# EAGLE schematic m220noadder (EAGLE 4.11)
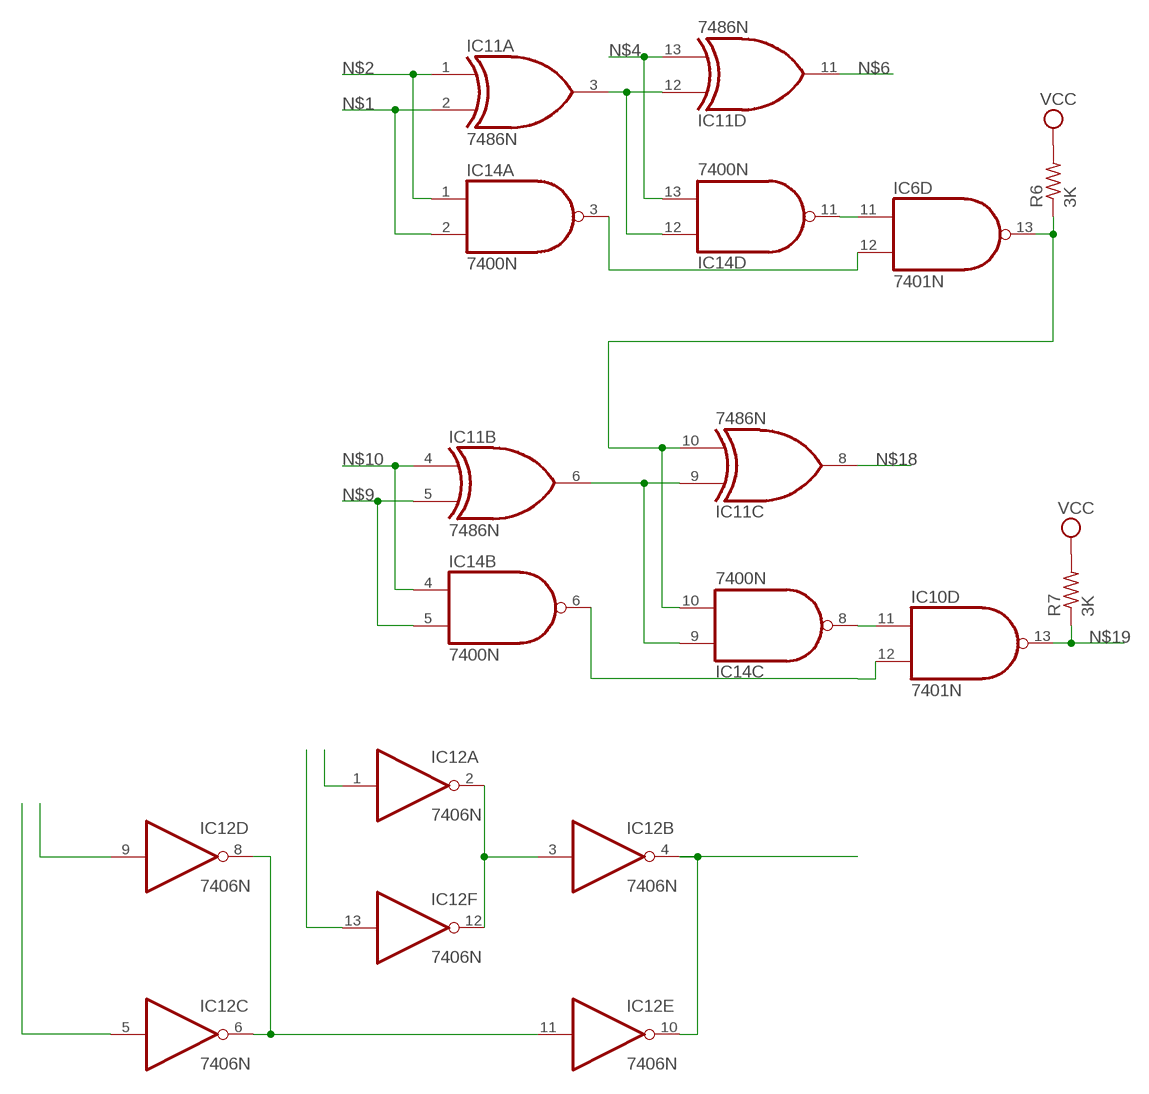
[diagram p0: schematic, sheet 1, part 1 of 2]
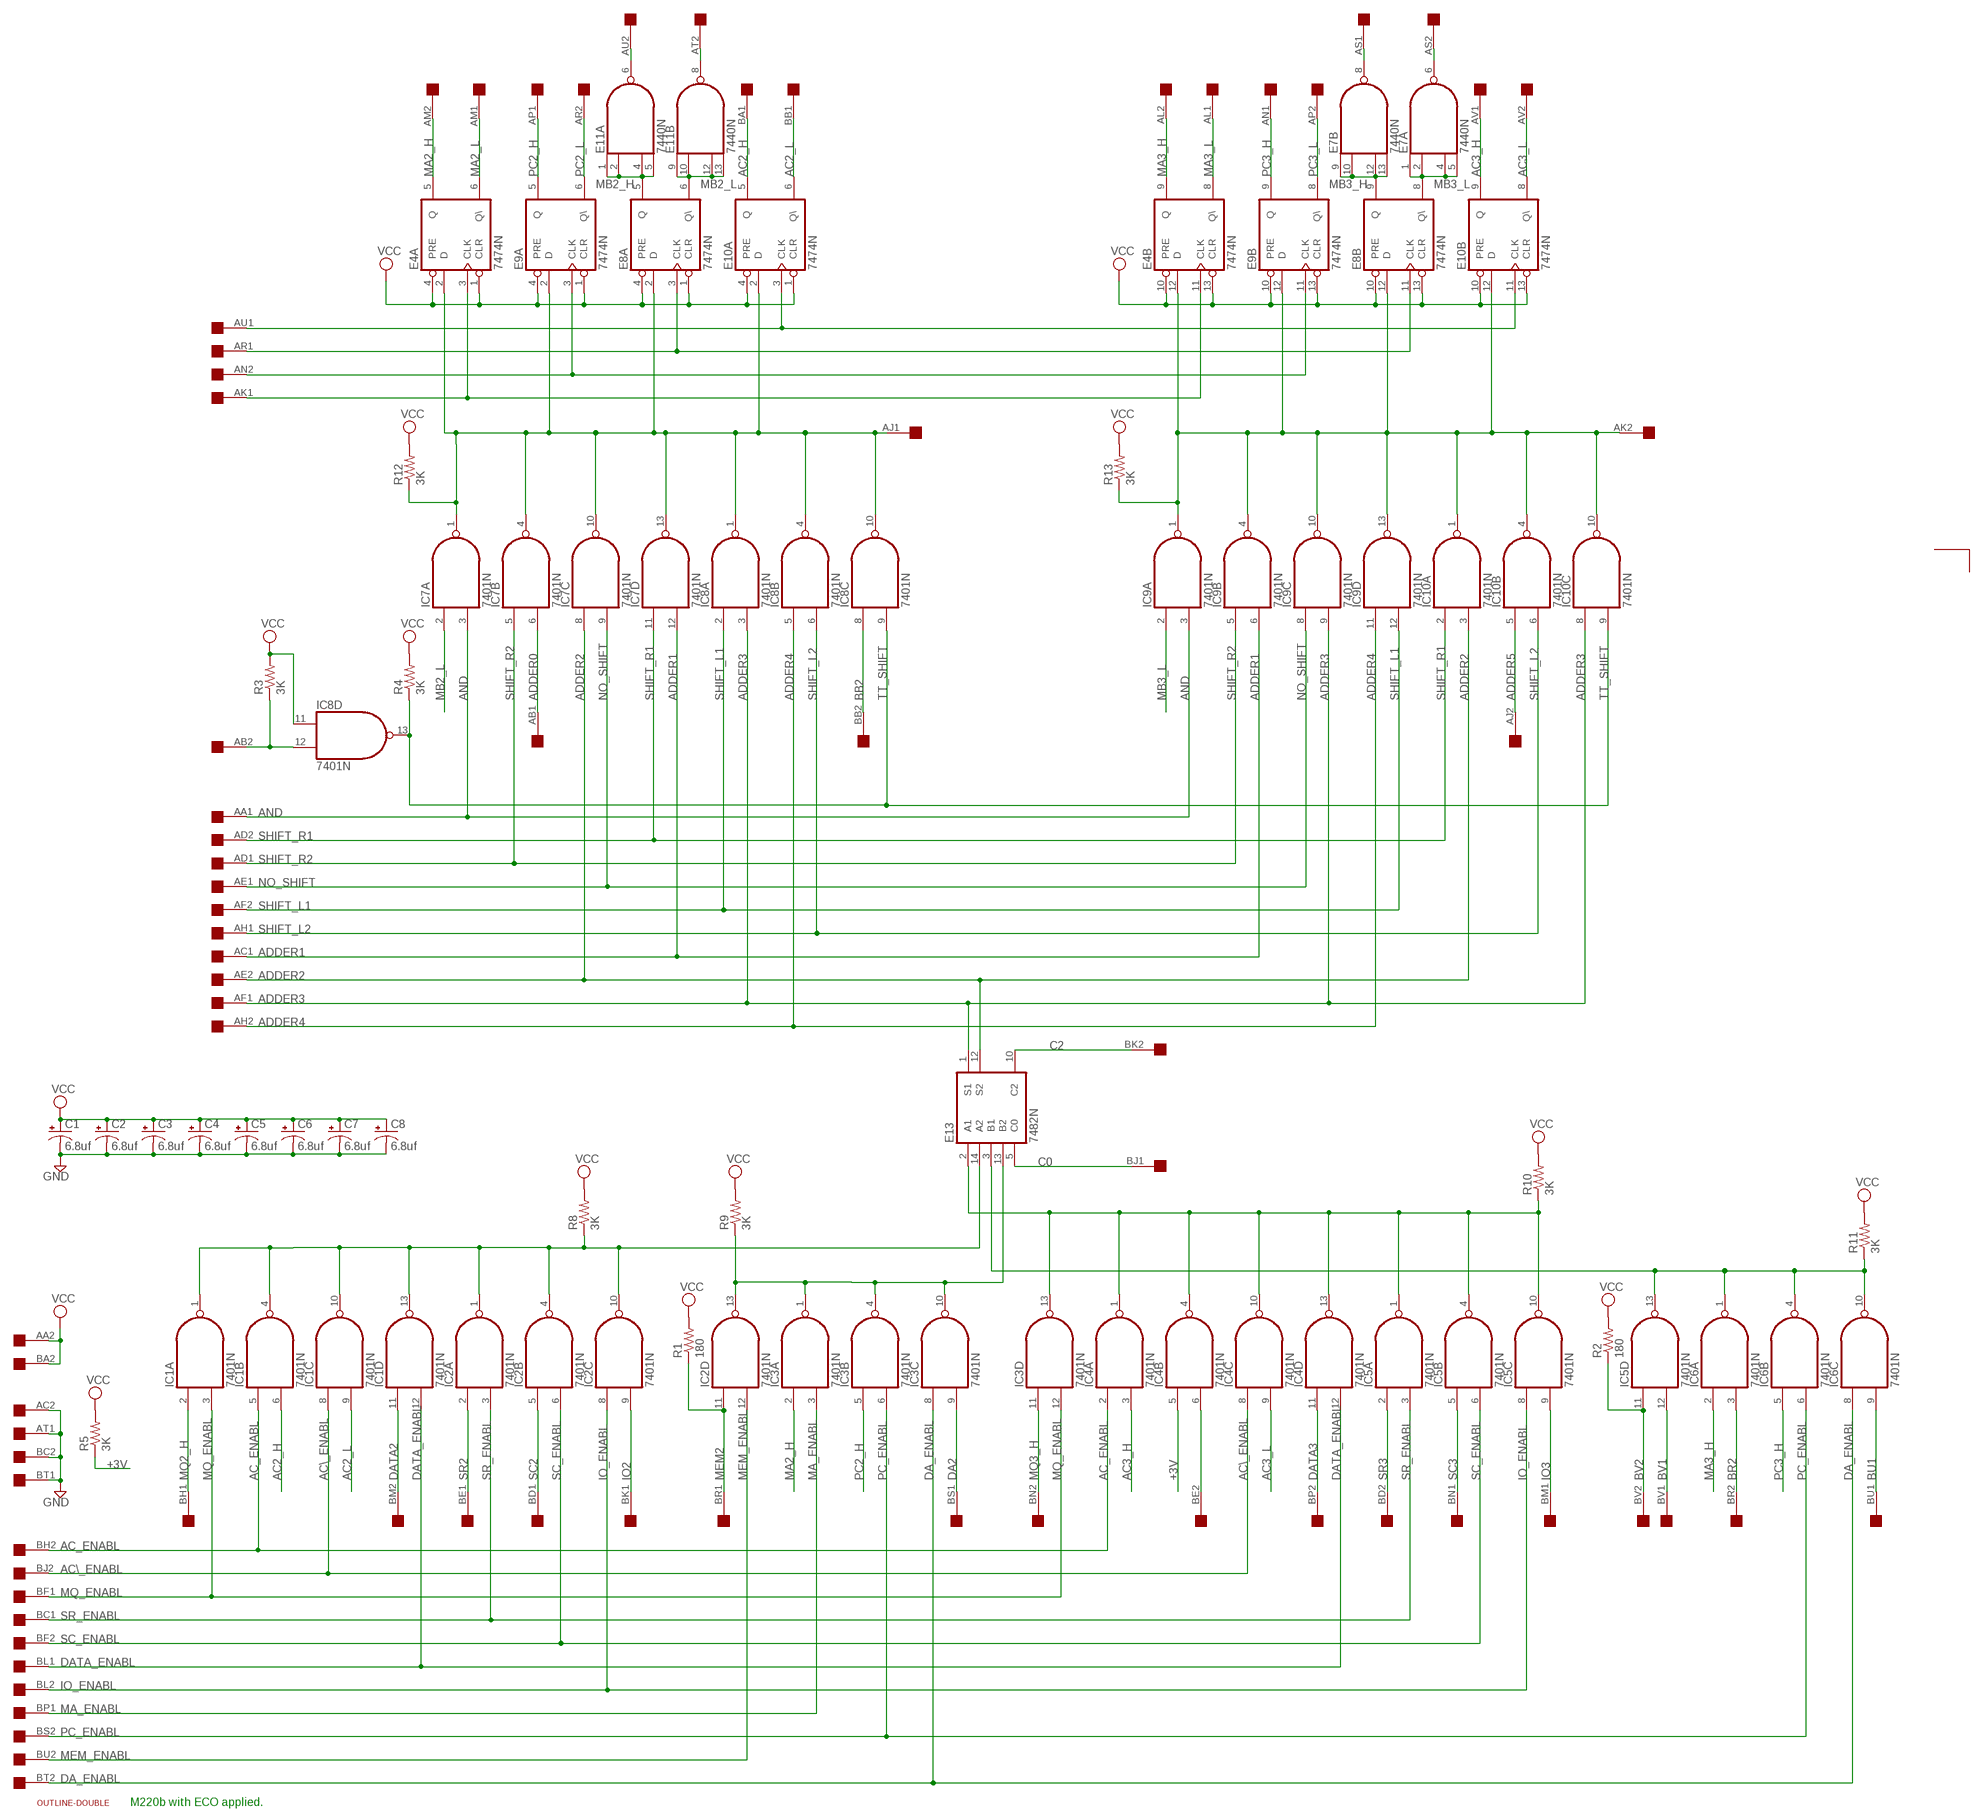
[diagram p1: schematic, sheet 1, part 2 of 2]

## Parts
C1  6.8uf  CPOL-USE15-5AXIAL  [E15-5]
C2  6.8uf  CPOL-USE15-5AXIAL  [E15-5]
C3  6.8uf  CPOL-USE15-5AXIAL  [E15-5]
C4  6.8uf  CPOL-USE15-5AXIAL  [E15-5]
C5  6.8uf  CPOL-USE15-5AXIAL  [E15-5]
C6  6.8uf  CPOL-USE15-5AXIAL  [E15-5]
C7  6.8uf  CPOL-USE15-5AXIAL  [E15-5]
C8  6.8uf  CPOL-USE15-5AXIAL  [E15-5]
E4  7474N  74S74N  [DIL14]
E7  7440N  74S20N  [DIL14]
E8  7474N  74S74N  [DIL14]
E9  7474N  74S74N  [DIL14]
E10  7474N  74S74N  [DIL14]
E11  7440N  74S20N  [DIL14]
E13  7482N  [DIL14]
IC1  7401N  [DIL14]
IC2  7401N  [DIL14]
IC3  7401N  [DIL14]
IC4  7401N  [DIL14]
IC5  7401N  [DIL14]
IC6  7401N  [DIL14]
IC7  7401N  [DIL14]
IC8  7401N  [DIL14]
IC9  7401N  [DIL14]
IC10  7401N  [DIL14]
IC11  7486N  [DIL14]
IC12  7406N  [DIL14]
IC14  7400N  [DIL14]
R1  180  R-US_0207/10  [0207/10]
R2  180  R-US_0207/10  [0207/10]
R3  3K  R-US_0207/10  [0207/10]
R4  3K  R-US_0207/10  [0207/10]
R5  3K  R-US_0207/10  [0207/10]
R6  3K  R-US_0207/10  [0207/10]
R7  3K  R-US_0207/10  [0207/10]
R8  3K  R-US_0207/10  [0207/10]
R9  3K  R-US_0207/10  [0207/10]
R10  3K  R-US_0207/10  [0207/10]
R11  3K  R-US_0207/10  [0207/10]
R12  3K  R-US_0207/10  [0207/10]
R13  3K  R-US_0207/10  [0207/10]
U$1  DOUBLE  [EDGE-CON4]
U$2  OUTLINE-DOUBLE  [DOUBLE]

## Nets
+3V: IC4.5(B:I0) R5.1
AC2_H: E10.5(A:Q) IC1.6(B:I1) U$1.BA1
AC2_L: E10.6(A:Q\) IC1.9(C:I1) U$1.BB1
AC3_H: E10.9(B:Q) IC4.3(A:I1) U$1.AV1
AC3_L: E10.8(B:Q\) IC4.9(C:I1) U$1.AV2
AC\_ENABL: IC1.8(C:I0) IC4.8(C:I0) U$1.BJ2
AC_ENABL: IC1.5(B:I0) IC4.2(A:I0) U$1.BH2
ADDER0: IC7.6(B:I1) U$1.AB1
ADDER1: IC7.12(D:I1) IC9.6(B:I1) U$1.AC1
ADDER2: E13.12(S2) IC7.8(C:I0) IC10.3(A:I1) U$1.AE2
ADDER3: E13.1(S1) IC8.3(A:I1) IC9.9(C:I1) IC10.8(C:I0) U$1.AF1
ADDER4: IC8.5(B:I0) IC9.11(D:I0) U$1.AH2
ADDER5: IC10.5(B:I0) U$1.AJ2
AJ1: E4.2(A:D) E8.2(A:D) E9.2(A:D) E10.2(A:D) IC7.1(A:O) IC7.4(B:O) IC7.10(C:O) IC7.13(D:O) IC8.1(A:O) IC8.4(B:O) IC8.10(C:O) R12.1 U$1.AJ1
AK1: E4.3(A:CLK) E4.11(B:CLK) U$1.AK1
AK2: E4.12(B:D) E8.12(B:D) E9.12(B:D) E10.12(B:D) IC9.1(A:O) IC9.4(B:O) IC9.10(C:O) IC9.13(D:O) IC10.1(A:O) IC10.4(B:O) IC10.10(C:O) R13.1 U$1.AK2
AN2: E9.3(A:CLK) E9.11(B:CLK) U$1.AN2
AND: IC7.3(A:I1) IC9.3(A:I1) U$1.AA1
AR1: E8.3(A:CLK) E8.11(B:CLK) U$1.AR1
AS1: E7.8(B:O) U$1.AS1
AS2: E7.6(A:O) U$1.AS2
AT2: E11.8(B:O) U$1.AT2
AU1: E10.3(A:CLK) E10.11(B:CLK) U$1.AU1
AU2: E11.6(A:O) U$1.AU2
BB2: IC8.8(C:I0) U$1.BB2
BE2: IC4.6(B:I1) U$1.BE2
BR2: IC6.3(A:I1) U$1.BR2
BU1: IC6.9(C:I1) U$1.BU1
BV1: IC5.12(D:I1) U$1.BV1
BV2: IC5.11(D:I0) R2.1 U$1.BV2
C0: E13.5(C0) U$1.BJ1
C2: E13.10(C2) U$1.BK2
DA2: IC3.9(C:I1) U$1.BS1
DA_ENABL: IC3.8(C:I0) IC6.8(C:I0) U$1.BT2
DATA2: IC1.11(D:I0) U$1.BM2
DATA3: IC4.11(D:I0) U$1.BP2
DATA_ENABL: IC1.12(D:I1) IC4.12(D:I1) U$1.BL1
GND: C1.- C2.- C3.- C4.- C5.- C6.- C7.- C8.- U$1.AC2 U$1.AT1 U$1.BC2 U$1.BT1
IO2: IC2.9(C:I1) U$1.BK1
IO3: IC5.9(C:I1) U$1.BM1
IO_ENABL: IC2.8(C:I0) IC5.8(C:I0) U$1.BL2
MA2_H: E4.5(A:Q) IC3.2(A:I0) U$1.AM2
MA2_L: E4.6(A:Q\) U$1.AM1
MA3_H: E4.9(B:Q) IC6.2(A:I0) U$1.AL2
MA3_L: E4.8(B:Q\) U$1.AL1
MA_ENABL: IC3.3(A:I1) U$1.BP1
MB2_H: E8.5(A:Q) E11.1(A:I0) E11.2(A:I1) E11.4(A:I2) E11.5(A:I3)
MB2_L: E8.6(A:Q\) E11.9(B:I0) E11.10(B:I1) E11.12(B:I2) E11.13(B:I3) IC7.2(A:I0)
MB3_H: E7.9(B:I0) E7.10(B:I1) E7.12(B:I2) E7.13(B:I3) E8.9(B:Q)
MB3_L: E7.1(A:I0) E7.2(A:I1) E7.4(A:I2) E7.5(A:I3) E8.8(B:Q\) IC9.2(A:I0)
MEM2: IC2.11(D:I0) R1.1 U$1.BR1
MEM_ENABL: IC2.12(D:I1) U$1.BU2
MQ2_H: IC1.2(A:I0) U$1.BH1
MQ3_H: IC3.11(D:I0) U$1.BN2
MQ_ENABL: IC1.3(A:I1) IC3.12(D:I1) U$1.BF1
N$1: IC11.2(A:I1) IC14.2(A:I1)
N$2: IC11.1(A:I0) IC14.1(A:I0)
N$3: IC11.3(A:O) IC11.12(D:I0) IC14.12(D:I0)
N$4: IC11.13(D:I1) IC14.13(D:I1)
N$5: E13.14(A2) IC1.1(A:O) IC1.4(B:O) IC1.10(C:O) IC1.13(D:O) IC2.1(A:O) IC2.4(B:O) IC2.10(C:O) R8.1
N$6: IC11.11(D:O)
N$7: IC6.12(D:I1) IC14.3(A:O)
N$8: E13.2(A1) IC3.13(D:O) IC4.1(A:O) IC4.4(B:O) IC4.10(C:O) IC4.13(D:O) IC5.1(A:O) IC5.4(B:O) IC5.10(C:O) R10.1
N$9: IC11.5(B:I1) IC14.5(B:I1)
N$10: IC11.4(B:I0) IC14.4(B:I0)
N$11: IC11.6(B:O) IC11.9(C:I0) IC14.9(C:I0)
N$12: E13.13(B2) IC2.13(D:O) IC3.1(A:O) IC3.4(B:O) IC3.10(C:O) R9.1
N$13: IC6.13(D:O) IC11.10(C:I1) IC14.10(C:I1) R6.1
N$14: E13.3(B1) IC5.13(D:O) IC6.1(A:O) IC6.4(B:O) IC6.10(C:O) R11.1
N$15: IC10.12(D:I1) IC14.6(B:O)
N$16: IC6.11(D:I0) IC14.11(D:O)
N$17: IC10.11(D:I0) IC14.8(C:O)
N$18: IC11.8(C:O)
N$19: IC10.13(D:O) R7.1
N$20: IC12.5(C:I)
N$21: IC12.9(D:I)
N$22: IC12.6(C:O) IC12.8(D:O) IC12.11(E:I)
N$23: IC12.13(F:I)
N$24: IC12.1(A:I)
N$25: IC12.2(A:O) IC12.3(B:I) IC12.12(F:O)
N$26: IC12.4(B:O) IC12.10(E:O)
NO_SHIFT: IC7.9(C:I1) IC9.8(C:I0) U$1.AE1
PC2_H: E9.5(A:Q) IC3.5(B:I0) U$1.AP1
PC2_L: E9.6(A:Q\) U$1.AR2
PC3_H: E9.9(B:Q) IC6.5(B:I0) U$1.AN1
PC3_L: E9.8(B:Q\) U$1.AP2
PC_ENABL: IC3.6(B:I1) IC6.6(B:I1) U$1.BS2
SC2: IC2.5(B:I0) U$1.BD1
SC3: IC5.5(B:I0) U$1.BN1
SC_ENABL: IC2.6(B:I1) IC5.6(B:I1) U$1.BF2
SHIFT_L1: IC8.2(A:I0) IC9.12(D:I1) U$1.AF2
SHIFT_L2: IC8.6(B:I1) IC10.6(B:I1) U$1.AH1
SHIFT_R1: IC7.11(D:I0) IC10.2(A:I0) U$1.AD2
SHIFT_R2: IC7.5(B:I0) IC9.5(B:I0) U$1.AD1
SR2: IC2.2(A:I0) U$1.BE1
SR3: IC5.2(A:I0) U$1.BD2
SR_ENABL: IC2.3(A:I1) IC5.3(A:I1) U$1.BC1
TT_SHIFT: IC8.9(C:I1) IC8.13(D:O) IC10.9(C:I1) R4.1
TT_SHIFT\: IC8.12(D:I1) R3.1 U$1.AB2
VCC: C1.+ C2.+ C3.+ C4.+ C5.+ C6.+ C7.+ C8.+ E4.1(A:CLR) E4.4(A:PRE) E4.10(B:PRE) E4.13(B:CLR) E8.1(A:CLR) E8.4(A:PRE) E8.10(B:PRE) E8.13(B:CLR) E9.1(A:CLR) E9.4(A:PRE) E9.10(B:PRE) E9.13(B:CLR) E10.1(A:CLR) E10.4(A:PRE) E10.10(B:PRE) E10.13(B:CLR) IC8.11(D:I0) R1.2 R2.2 R3.2 R4.2 R5.2 R6.2 R7.2 R8.2 R9.2 R10.2 R11.2 R12.2 R13.2 U$1.AA2 U$1.BA2

## Notes on the sheet
- M220b with ECO applied.

## Power pins joined to a net without a drawn wire
GND: E4.7(P:GND) E7.7(P:GND) E8.7(P:GND) E9.7(P:GND) E10.7(P:GND) E11.7(P:GND) E13.11(GND) IC1.7(P:GND) IC2.7(P:GND) IC3.7(P:GND) IC4.7(P:GND) IC5.7(P:GND) IC6.7(P:GND) IC7.7(P:GND) IC8.7(P:GND) IC9.7(P:GND) IC10.7(P:GND) IC11.7(P:GND) IC12.7(P:GND) IC14.7(P:GND)
VCC: E4.14(P:VCC) E7.14(P:VCC) E8.14(P:VCC) E9.14(P:VCC) E10.14(P:VCC) E11.14(P:VCC) E13.4(VCC) IC1.14(P:VCC) IC2.14(P:VCC) IC3.14(P:VCC) IC4.14(P:VCC) IC5.14(P:VCC) IC6.14(P:VCC) IC7.14(P:VCC) IC8.14(P:VCC) IC9.14(P:VCC) IC10.14(P:VCC) IC11.14(P:VCC) IC12.14(P:VCC) IC14.14(P:VCC)

## Library data of the parts
C1-C8 = rcl:CPOL-US: POLARIZED CAPACITOR, American symbol
E4 E8-E10 = 74xx-us:74*74: Dual D type positive edge triggered FLIP FLOP, preset and clear
E7 E11 = 74xx-jameco:74*20: Dual 4-input NAND gate
E13 = 74xx-eu:74*82: 2-bit binary full ADDER
IC1-IC10 = 74xx-jameco:74*01: Quad 2-input NAND gate, open collector
IC11 = 74xx-jameco:74*86: Quad 2-input EXCLUSIV-OR (XOR) gate
IC12 = 74xx-jameco:74*06: Hex INVERTER, open collector high-voltage output
IC14 = 74xx-jameco:74*00: Quad 2-input NAND gate
R1-R13 = rcl:R-US_: RESISTOR, American symbol
U$1 = dec-con:DOUBLE: Double-Height DEC board
U$2 = dec-con:OUTLINE-*: Board outlines for DEC boards.